# Altium schematic sheet Heater.SchDoc
size A4
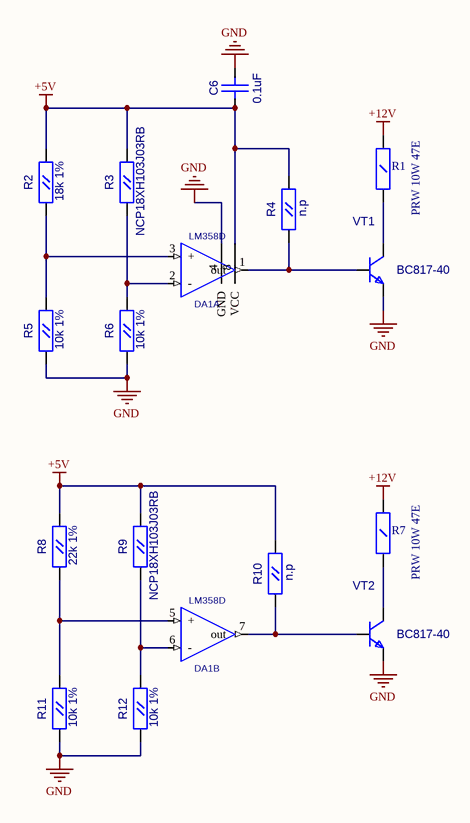
[diagram p0: Heater.SchDoc]

## Parts
C6  0.1uF  [CC0603]
DA1  LM358D  [SO-8]  (parts A,B of 2)
R1  PRW 10W 47E  [R_5W_Cement]
R2  18k 1%  [RC0603]
R3  NCP18XH103J03RB  [RC0603]
R4  n.p  [RC0603]
R5  10k 1%  [RC0603]
R6  10k 1%  [RC0603]
R7  PRW 10W 47E  [R_5W_Cement]
R8  22k 1%  [RC0603]
R9  NCP18XH103J03RB  [RC0603]
R10  n.p  [RC0603]
R11  10k 1%  [RC0603]
R12  10k 1%  [RC0603]
VT1  BC817-40  [SOT-23(123)]
VT2  BC817-40  [SOT-23(123)]

## Nets
+5V: C6.1(A) DA1.8(VCC) R2.2(B) R3.2(B) R4.2(B) R8.2(B) R9.2(B) R10.2(B)
+12V: R1.2(B) R7.2(B)
GND: C6.2(B) DA1.4(GND) R5.1(A) R6.1(A) R11.1(A) R12.1(A) VT1.2(E) VT2.2(E)
NetDA1_1: DA1.1(out) R4.1(A) VT1.1(B)
NetDA1_2: DA1.2(-) R3.1(A) R6.2(B)
NetDA1_3: DA1.3(+) R2.1(A) R5.2(B)
NetDA1_5: DA1.5(+) R8.1(A) R11.2(B)
NetDA1_6: DA1.6(-) R9.1(A) R12.2(B)
NetDA1_7: DA1.7(out) R10.1(A) VT2.1(B)
NetR1_1: R1.1(A) VT1.3(C)
NetR7_1: R7.1(A) VT2.3(C)

## Library data of the parts
C6 = CC0603: Value: 0.1uF
R1 R7 = R_10W: Value: PRW 10W 47E
R2-R6 R8-R12 = RC0603
  R2: Value: 18k 1%
  R3 R9: Value: NCP18XH103J03RB
  R4 R10: Value: n.p
  R5 R6 R11 R12: Value: 10k 1%
  R8: Value: 22k 1%
VT1 VT2 = BC846BLT1: NPN 500ma transistor; ComponentField7: Published 29-Sep-2000; OriginalName: BC846BLT1; Value: BC817-40
DA1 = LM358D: Value: *